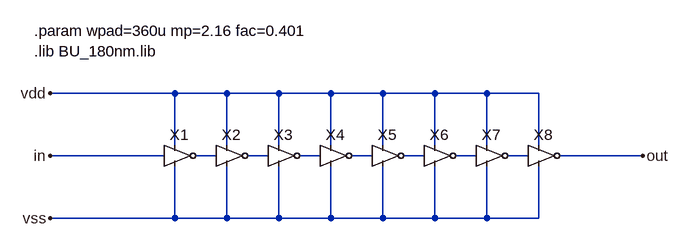
[diagram p0: schematic pad_buffer.asc]
pad_buffer.asc, the LTspice schematic file:
Version 4
SHEET 1 1168 680
WIRE 176 224 -16 224
WIRE 256 224 176 224
WIRE 336 224 256 224
WIRE 416 224 336 224
WIRE 496 224 416 224
WIRE 576 224 496 224
WIRE 656 224 576 224
WIRE 736 224 656 224
WIRE 176 304 176 224
WIRE 256 304 256 224
WIRE 336 304 336 224
WIRE 416 304 416 224
WIRE 496 304 496 224
WIRE 576 304 576 224
WIRE 656 304 656 224
WIRE 736 304 736 224
WIRE 160 320 -16 320
WIRE 240 320 208 320
WIRE 320 320 288 320
WIRE 400 320 368 320
WIRE 480 320 448 320
WIRE 560 320 528 320
WIRE 640 320 608 320
WIRE 720 320 688 320
WIRE 896 320 768 320
WIRE 176 416 176 336
WIRE 176 416 -16 416
WIRE 256 416 256 336
WIRE 256 416 176 416
WIRE 336 416 336 336
WIRE 336 416 256 416
WIRE 416 416 416 336
WIRE 416 416 336 416
WIRE 496 416 496 336
WIRE 496 416 416 416
WIRE 576 416 576 336
WIRE 576 416 496 416
WIRE 656 416 656 336
WIRE 656 416 576 416
WIRE 736 416 736 336
WIRE 736 416 656 416
FLAG -16 224 vdd
FLAG -16 320 in
FLAG 896 320 out
FLAG -16 416 vss
SYMBOL inv 176 320 R0
SYMATTR InstName X1
SYMATTR SpiceLine wn={wpad* fac * fac * fac * fac * fac * fac * fac } wp={wpad * mp * fac * fac * fac* fac * fac* fac * fac }
SYMBOL inv 256 320 R0
SYMATTR InstName X2
SYMATTR SpiceLine wn={wpad* fac * fac * fac * fac * fac * fac } wp={wpad * mp * fac * fac * fac* fac * fac* fac}
SYMBOL inv 336 320 R0
SYMATTR InstName X3
SYMATTR SpiceLine wn={wpad* fac * fac * fac * fac * fac} wp={wpad * mp * fac * fac * fac* fac * fac}
SYMBOL inv 416 320 R0
SYMATTR InstName X4
SYMATTR SpiceLine wn={wpad* fac * fac * fac * fac} wp={wpad * mp * fac * fac * fac* fac}
SYMBOL inv 496 320 R0
SYMATTR InstName X5
SYMATTR SpiceLine wn={wpad* fac * fac * fac} wp={wpad * mp * fac * fac * fac}
SYMBOL inv 576 320 R0
SYMATTR InstName X6
SYMATTR SpiceLine wn={wpad* fac * fac} wp={wpad * mp * fac* fac}
SYMBOL inv 656 320 R0
SYMATTR InstName X7
SYMATTR SpiceLine wn={wpad* fac} wp={wpad * mp * fac}
SYMBOL inv 736 320 R0
SYMATTR InstName X8
SYMATTR SpiceLine wn={wpad} wp={wpad * mp}
TEXT -40 128 Left 2 !.param wpad=360u mp=2.16 fac=0.401\n.lib BU_180nm.lib

The netlist it stands for:
* pad_buffer.asc
XX1 in N001 vdd vss inv wn={wpad* fac * fac * fac * fac * fac * fac * fac } wp={wpad * mp * fac * fac * fac* fac * fac* fac * fac }  ; pins In _Q vdd vss
XX2 N001 N002 vdd vss inv wn={wpad* fac * fac * fac * fac * fac * fac } wp={wpad * mp * fac * fac * fac* fac * fac* fac}  ; pins In _Q vdd vss
XX3 N002 N003 vdd vss inv wn={wpad* fac * fac * fac * fac * fac} wp={wpad * mp * fac * fac * fac* fac * fac}  ; pins In _Q vdd vss
XX4 N003 N004 vdd vss inv wn={wpad* fac * fac * fac * fac} wp={wpad * mp * fac * fac * fac* fac}  ; pins In _Q vdd vss
XX5 N004 N005 vdd vss inv wn={wpad* fac * fac * fac} wp={wpad * mp * fac * fac * fac}  ; pins In _Q vdd vss
XX6 N005 N006 vdd vss inv wn={wpad* fac * fac} wp={wpad * mp * fac* fac}  ; pins In _Q vdd vss
XX7 N006 N007 vdd vss inv wn={wpad* fac} wp={wpad * mp * fac}  ; pins In _Q vdd vss
XX8 N007 out vdd vss inv wn={wpad} wp={wpad * mp}  ; pins In _Q vdd vss
.param wpad=360u mp=2.16 fac=0.401
.lib BU_180nm.lib
.backanno
.end